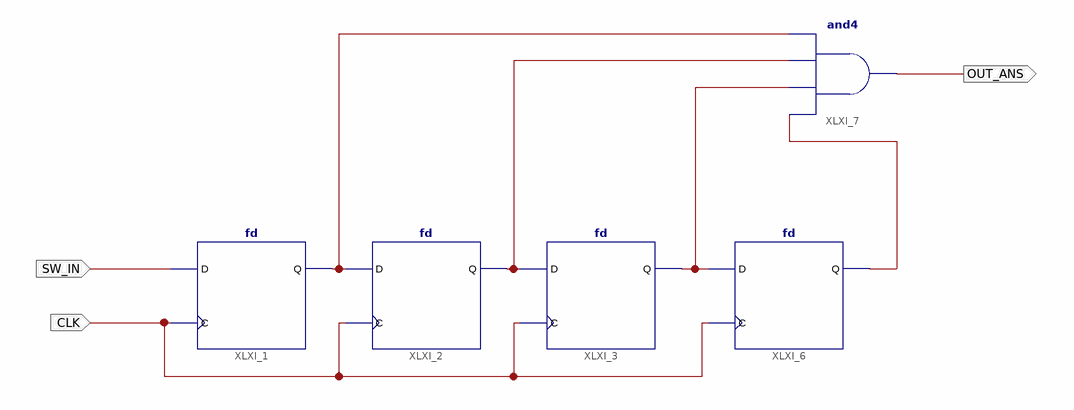
[diagram p0: schematic sheet 1]
// Xilinx ISE schematic debounce.sch (spartan6) as structural Verilog: 5 symbols, 3 ports
module debounce (
  input  SW_IN,
  input  CLK,
  output OUT_ANS
);

  wire XLXN_5, XLXN_6, XLXN_8, XLXN_9;

  fd XLXI_1 (.C(CLK), .D(SW_IN), .Q(XLXN_5));
  fd XLXI_2 (.C(CLK), .D(XLXN_5), .Q(XLXN_6));
  fd XLXI_3 (.C(CLK), .D(XLXN_6), .Q(XLXN_8));
  fd XLXI_6 (.C(CLK), .D(XLXN_8), .Q(XLXN_9));
  and XLXI_7 (OUT_ANS, XLXN_9, XLXN_8, XLXN_6, XLXN_5);
endmodule
